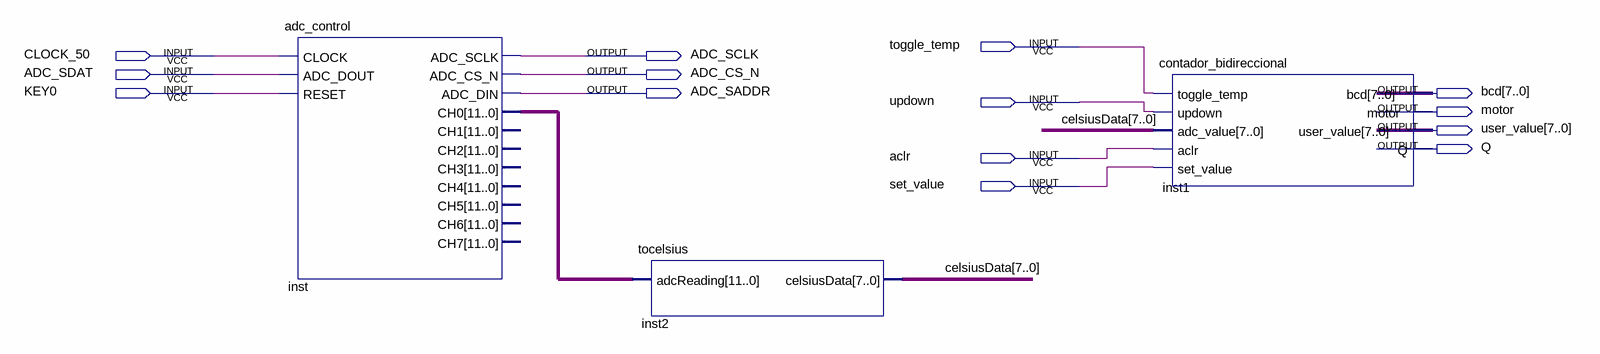
[diagram p0: schematic sheet]
// Quartus schematic tempeture_control.bdf as structural Verilog: 3 symbols, 14 pins
module tempeture_control (
  input  toggle_temp,
  input  CLOCK_50,
  input  ADC_SDAT,
  input  KEY0,
  input  updown,
  input  aclr,
  input  set_value,
  output ADC_SCLK,
  output ADC_CS_N,
  output ADC_SADDR,
  output [7:0] bcd,
  output motor,
  output [7:0] user_value,
  output Q
);

  wire [7:0] celsiusData;
  wire [11:0] inst_ch0;

  adc_control inst (
    .CLOCK(CLOCK_50), .ADC_DOUT(ADC_SDAT), .RESET(KEY0), .ADC_SCLK(ADC_SCLK), .ADC_CS_N(ADC_CS_N),
    .ADC_DIN(ADC_SADDR), .CH0(inst_ch0));  // open: CH1, CH2, CH3, CH4, CH5, CH6, CH7
  tocelsius inst2 (.adcReading(inst_ch0), .celsiusData(celsiusData));
  contador_bidireccional inst1 (
    .toggle_temp(toggle_temp), .updown(updown), .adc_value(celsiusData), .aclr(aclr), .set_value(set_value),
    .bcd(bcd), .motor(motor), .user_value(user_value), .Q(Q));
endmodule
